# Altium project Hardware.PrjPcb
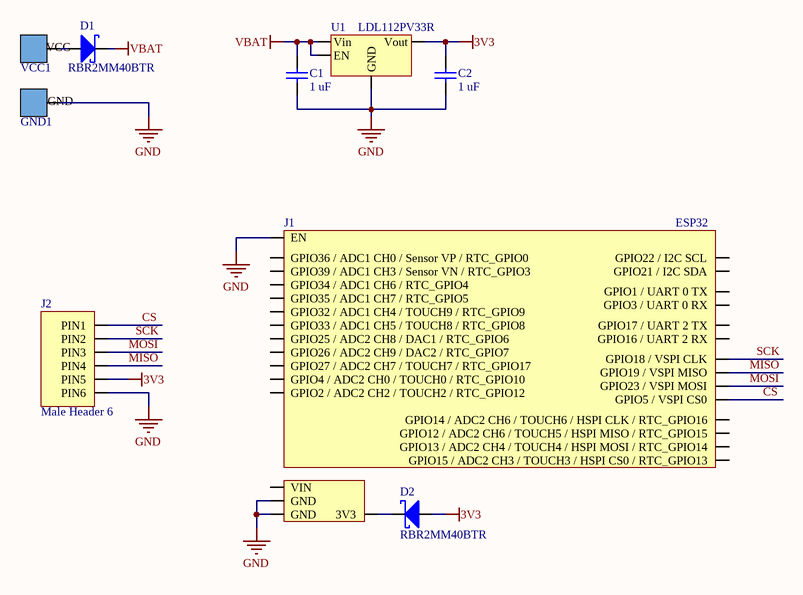
[diagram p0: Schematic.SchDoc]
1 sheet, 9 parts. Net scope: global (net labels, ports and power ports of the same name join across sheets).
Board file: Layout.PcbDoc

## Sheet Schematic.SchDoc
size A4; SheetNumber: 1; SheetTotal: 1

### Parts
C1  1 uF  [C0603]
C2  1 uF  [C0603]
D1  RBR2MM40BTR  [DIODO_SOD-123FL-2]
D2  RBR2MM40BTR  [DIODO_SOD-123FL-2]
GND1  Ground Pad  [PAD_ALIMENTAÇÃO_MINI]  (value not drawn)
J1  ESP32  [Modulo ESP32]
J2  Male Header 6  [MALE HEADER 6]
U1  LDL112PV33R  [DFN-6]
VCC1  Source Pad  [PAD_ALIMENTAÇÃO_MINI]  (value not drawn)

### Nets
3V3: C2.2 D2.A J2.PIN5 U1.4(Vout)
GND: C1.1 C2.1 GND1.A(GND) J1.EN J1.GND J2.PIN6 U1.2(GND)
VBAT: C1.2 D1.C U1.1(EN) U1.6(Vin)
CS: J1.PIN23(GPIO5_/_VSPI_CS0) J2.PIN1
MISO: J1.PIN21(GPIO19_/_VSPI_MISO) J2.PIN4
MOSI: J1.PIN16(GPIO23_/_VSPI_MOSI) J2.PIN3
SCK: J1.PIN22(GPIO18_/_VSPI_CLK) J2.PIN2
NetD1_A: D1.A VCC1.A(VCC)
NetD2_C: D2.C J1.3V3

Not connected (* = marked no-connect by the designer): J1 PIN2(GPIO36_/_ADC1_CH0_/_Sensor_VP_/_RTC_GPIO0) PIN3(GPIO39_/_ADC1_CH3_/_Sensor_VN_/_RTC_GPIO3) PIN4(GPIO34_/_ADC1_CH6_/_RTC_GPIO4) PIN5(GPIO35_/_ADC1_CH7_/_RTC_GPIO5) PIN6(GPIO32_/_ADC1_CH4_/_TOUCH9_/_RTC_GPIO9) PIN7(GPIO33_/_ADC1_CH5_/_TOUCH8_/_RTC_GPIO8) PIN8(GPIO25_/_ADC2_CH8_/_DAC1_/_RTC_GPIO6) PIN9(GPIO26_/_ADC2_CH9_/_DAC2_/_RTC_GPIO7) PIN10(GPIO27_/_ADC2_CH7_/_TOUCH7_/_RTC_GPIO17) PIN11(GPIO14_/_ADC2_CH6_/_TOUCH6_/_HSPI_CLK_/_RTC_GPIO16) PIN12(GPIO12_/_ADC2_CH6_/_TOUCH5_/_HSPI_MISO_/_RTC_GPIO15) PIN13(GPIO13_/_ADC2_CH4_/_TOUCH4_/_HSPI_MOSI_/_RTC_GPIO14) PIN17(GPIO22_/_I2C_SCL) PIN18(GPIO1_/_UART_0_TX) PIN19(GPIO3_/_UART_0_RX) PIN20(GPIO21_/_I2C_SDA) PIN24(GPIO17_/_UART_2_TX) PIN25(GPIO16_/_UART_2_RX) PIN26(GPIO4_/_ADC2_CH0_/_TOUCH0_/_RTC_GPIO10) PIN27(GPIO2_/_ADC2_CH2_/_TOUCH2_/_RTC_GPIO12) PIN28(GPIO15_/_ADC2_CH3_/_TOUCH3_/_HSPI_CS0_/_RTC_GPIO13) VIN

### Library data of the parts
C1 C2 = GMK107BJ105KAHT: CAP CER 1uF 35V X5R 0603; Manufacturer: TAIYO YUDEN; Tolerance: 10%; Voltage - Rated: 35 VDC; Library Control - Checked Footprint: Yes; Library Control - Person that Checked Footprint: Nikaum; Supplier 1: MOUSER; Part Number: GMK107BJ105KAHT; Category: Ceramic Capacitor; Price: 1= 0.16, 10= 0,095, 100= 0,049 (USD); Supplier Part Number 1: 963-GMK107BJ105KAHT; Library Ref: Capacitor; Operating Temperature: -55 C ~ 85 C; Package / Case: 0603 (1608 Metric); Size / Dimension: 1,60 L x 0,80 W x 0,90 H; Value: 1 uF; ESR: -; Dieletric: X5R; Library Control - Checked Schematic: Yes; Library Control - Last Update: 28/06/2021 00:40; Library Control - Person that Checked Schematic: Nikaum; Library Control - Person that did the Last Update Footprint: Nikaum; Library Control - Person that did the Last Update Schematic: Nikaum; ComponentLink1Description: Datasheet; ComponentLink1URL: https://br.mouser.com/datasheet/2/396/taiyo_yuden_12132018_mlcc11_hq_e-1510082.pdf; ComponentLink2Description: Mouser Link; ComponentLink2URL: https://br.mouser.com/ProductDetail/Taiyo-Yuden/GMK107BJ105KAHT?qs=%2Fha2pyFadugfgsXIlkotQ92wbBztYfVCYQK4eynXE%252B0k6svEXRnruHVeQhZpuewN
D1 D2 = RBR2MM40BTR: DIODE SCHOTTKY 40V 2A SOD-123FL-2; Manufacturer: ROHM Semiconductor; Max Forward Surge Current (Ifsm): 30 A; Current - Reverse Leakage @ Vr: 80 uA @ 40V; Voltage - Forward (Vf) (Max) @ If: 560 mV @ 2A; Library Control - Person that did the Last Update Schematic: Maria Laura; Supplier 1: Mouser; Part Number: RBR2MM40BTR; Category: Schottky Diodes & Rectifiers; Price: 1=0,5; 10=0,414; 100=0,282; Package / Case: SOD-123FL-2; Current - Average Rectified (Io): 2 A; Operating Temperature: - 55 C ~ + 150 C; Voltage - DC Reverse (Vr) (Max): 40 V; Diode Type: Schottky; Library Ref: Diodo/Led; Supplier Part Number 1: 755-RBR2MM40BTR; Library Control - Last Update: 07/10/2022 17:54; ComponentLink1Description: Mouser Link; ComponentLink1URL: https://br.mouser.com/ProductDetail/?qs=sErY3DeL0TgU%252BzPQs2wkpg%3D%3D; ComponentLink2Description: Datasheet; ComponentLink2URL: https://br.mouser.com/datasheet/2/348/rbr2mm40btr_e-1870596.pdf
GND1 = Ground Pad Mini Sumô: GND PAD MINI SUMÔ; Cable AWG: 20 / 18 (AWG); Recomended Category: Mini Sumô; Size: 3.5 x 3.5 (mm); Library Ref: Pads
J1 = Modulo ESP32: Header Modulo ESP32; Number of Contacts: 15; Library Control - Checked Footprint: Nikaum; Library Ref: Header; Library Control - Checked Schematic: Nikaum; Library Control - Last Project that Used: *; Library Control - Last Update: *; Library Control - Person that Checked Footprint: *; Library Control - Person that Checked Schematic: *; Library Control - Person that did the Last Update Schematic: Nikaum; Library Control - Persont that did the Last Update Footprint: Nikaum
J2 = Male Header 6: Number of Contacts: 6; Library Control - Checked Footprint: Yes; Library Control - Person that Checked Footprint: Cage; System: Connector; Library Ref: Header; Library Control - Checked Schematic: Yes; Library Control - Last Project that Used: *; Library Control - Last Update: 02/10/2022; Library Control - Person that Checked Schematic: Cage; Library Control - Person that did the Last Update Schematic: Cage; Library Control - Persont that did the Last Update Footprint: Cage
U1 = LDL112PV33R: IC REG LINEAR 5V 200mA SOT-89-4
VCC1 = Source Pad Mini Sumô: VCC PAD MINI SUMÔ; Cable AWG: 20 / 18 (AWG); Recomended Category: Mini Sumô; Size: 3.5 x 3.5 (mm); Library Ref: Pads